# Altium project ACDC.PrjPcb
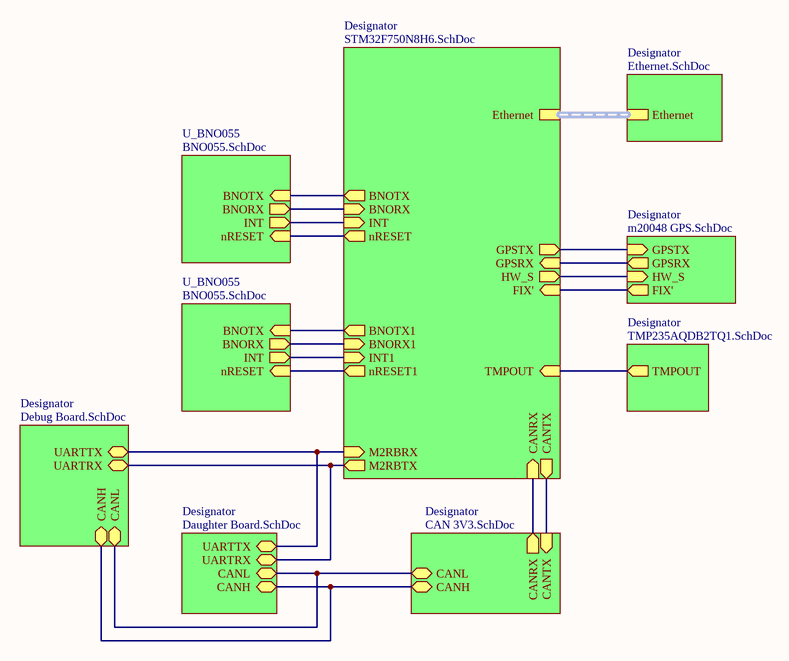
[diagram p0: ACDC.SchDoc]
9 sheets, 151 parts. Net scope: hierarchical (ports join the sheet entries above them; power ports are global).
Board file: ACDC.PcbDoc
Sheets:
  ACDC.SchDoc
    Designator = Daughter Board.SchDoc
    U_BNO055 = BNO055.SchDoc
    Designator = CAN 3V3.SchDoc
    Designator = m20048 GPS.SchDoc
    U_BNO055 = BNO055.SchDoc
    Designator = TMP235AQDB2TQ1.SchDoc
    Designator = STM32F750N8H6.SchDoc
    Designator = Ethernet.SchDoc
    Designator = Debug Board.SchDoc
      Designator = Daughter Board.SchDoc

## Sheet ACDC.SchDoc
size A

### Sub-sheets
Designator = Daughter Board.SchDoc: CANH (bidir), UARTTX (bidir), UARTRX (bidir), CANL (bidir)
Designator = CAN 3V3.SchDoc: CANL (bidir), CANH (bidir), CANRX (out), CANTX (in)
Designator = m20048 GPS.SchDoc: FIX' (out), HW_S (in), GPSRX (out), GPSTX (in)
Designator = TMP235AQDB2TQ1.SchDoc: TMPOUT (out)
Designator = STM32F750N8H6.SchDoc: INT (in), M2RBRX (in), HW_S (out), INT1 (in), nRESET (out), BNORX (in), GPSTX (out), M2RBTX (out), BNOTX (out), CANTX (out), BNORX1 (in), nRESET1 (out), BNOTX1 (out), TMPOUT (in), GPSRX (in), CANRX (in), FIX' (in), Ethernet (harness MII)
Designator = Ethernet.SchDoc: Ethernet (harness MII)
Designator = Debug Board.SchDoc: UARTRX (bidir), CANL (bidir), CANH (bidir), UARTTX (bidir)
U_BNO055 = BNO055.SchDoc: BNORX (out), INT (out), BNOTX (in), nRESET (in)
U_BNO055 = BNO055.SchDoc: BNORX (out), INT (out), BNOTX (in), nRESET (in)

### Nets
BNORX: sheet U_BNO055/BNORX, sheet Designator/BNORX
BNORX1: sheet U_BNO055/BNORX, sheet Designator/BNORX1
BNOTX: sheet U_BNO055/BNOTX, sheet Designator/BNOTX
BNOTX1: sheet U_BNO055/BNOTX, sheet Designator/BNOTX1
CANRX: sheet Designator/CANRX, sheet Designator/CANRX
CANTX: sheet Designator/CANTX, sheet Designator/CANTX
FIX': sheet Designator/FIX', sheet Designator/FIX'
GPSRX: sheet Designator/GPSRX, sheet Designator/GPSRX
GPSTX: sheet Designator/GPSTX, sheet Designator/GPSTX
HW_S: sheet Designator/HW_S, sheet Designator/HW_S
INT: sheet U_BNO055/INT, sheet Designator/INT
INT: sheet U_BNO055/INT, sheet Designator/INT1  [a separate net that carries the same name]
M2RBRX: sheet Designator/UARTTX, sheet Designator/M2RBRX, sheet Designator/UARTTX
M2RBTX: sheet Designator/UARTRX, sheet Designator/M2RBTX, sheet Designator/UARTRX
nRESET: sheet U_BNO055/nRESET, sheet Designator/nRESET
nRESET: sheet U_BNO055/nRESET, sheet Designator/nRESET1  [a separate net that carries the same name]
NetC160_2: sheet Designator/CANH, sheet Designator/CANH, sheet Designator/CANH
NetC162_2: sheet Designator/CANL, sheet Designator/CANL, sheet Designator/CANL
NetC167_1: sheet Designator/TMPOUT, sheet Designator/TMPOUT

## Sheet Daughter Board.SchDoc
size A
Used 2 times, as channels Designator, Designator/Designator. Parts and nets are listed once, with the designators drawn on the sheet.
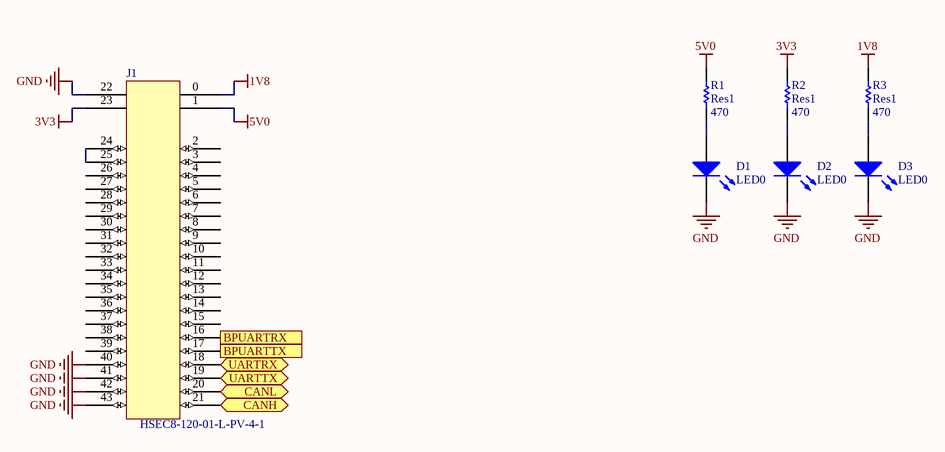
[diagram p1: Daughter Board.SchDoc]

### Parts
D1  LED0  [1608[0603]]
D2  LED0  [1608[0603]]
D3  LED0  [1608[0603]]
J1  HSEC8-120-01-L-PV-4-1  [HSEC8-120-01-L-PV-4-1 Gold Fingers]
R1  Res1  value 470  [1608[0603]]
R2  Res1  value 470  [1608[0603]]
R3  Res1  value 470  [1608[0603]]

### Ports
BPUARTRX (out), BPUARTTX (in), CANH (bidir), CANL (bidir), UARTRX (bidir), UARTTX (bidir)

### Nets
1V8: J1.0 R3.2
3V3: J1.23 R2.2
5V0: J1.1 R1.2
GND: D1.2(K) D2.2(K) D3.2(K) J1.22 J1.40 J1.41 J1.42 J1.43
BPUARTRX: J1.16 ; port BPUARTRX
BPUARTTX: J1.17 ; port BPUARTTX
CANH: J1.21 ; port CANH
CANL: J1.20 ; port CANL
UARTRX: J1.18 ; port UARTRX
UARTTX: J1.19 ; port UARTTX
NetD1_1: D1.1(A) R1.1
NetD2_1: D2.1(A) R2.1
NetD3_1: D3.1(A) R3.1
NetJ1_24: J1.24 J1.25

Not connected (* = marked no-connect by the designer): J1 2(0) 3(0) 4(0) 5(0) 6(0) 7(0) 8(0) 9(0) 10(0) 11(0) 12(0) 13(0) 14(0) 15(0) 26 27 28 29 30 31 32 33 34 35 36 37 38 39

### Channels
Designator: ports BPUARTRX=NetJ1_16 BPUARTTX=NetJ1_17 CANH=NetC160_2 CANL=NetC162_2 UARTRX=M2RBTX UARTTX=M2RBRX
Designator/Designator: designators end in _Designator_Designator; ports BPUARTRX=NetJ1_Designator_Designator_16 BPUARTTX=NetJ1_Designator_Designator_17 CANH=NetJ1_Designator_Designator_21 CANL=NetJ1_Designator_Designator_20 UARTRX=NetJ1_Designator_Designator_18 UARTTX=NetJ1_Designator_Designator_19

### Library data of the parts
R1-R3 = Res1: Resistor; Published: 8-Jun-2000; LatestRevisionDate: 17-Jul-2002; LatestRevisionNote: Re-released for DXP Platform.; PackageReference: AXIAL-0.3; Publisher: Altium Limited; PackageDescription: Axial Device, Thru-Hole; 2 Leads; 0.3 in Pin Spacing
D1-D3 = LED0: Published: 8-Jun-2000; LatestRevisionDate: 08-Jul-2005; LatestRevisionNote: Mech Layer 1 removed.; PackageReference: LED-0; Publisher: Altium Limited; PackageDescription: LED; 2 Leads
J1 = HSEC8-120-01-L-PV-4-1: Supplier 1: Mouser

## Sheet BNO055.SchDoc
size A
Used 2 times, as channels U_BNO055, U_BNO055. Parts and nets are listed once, with the designators drawn on the sheet.
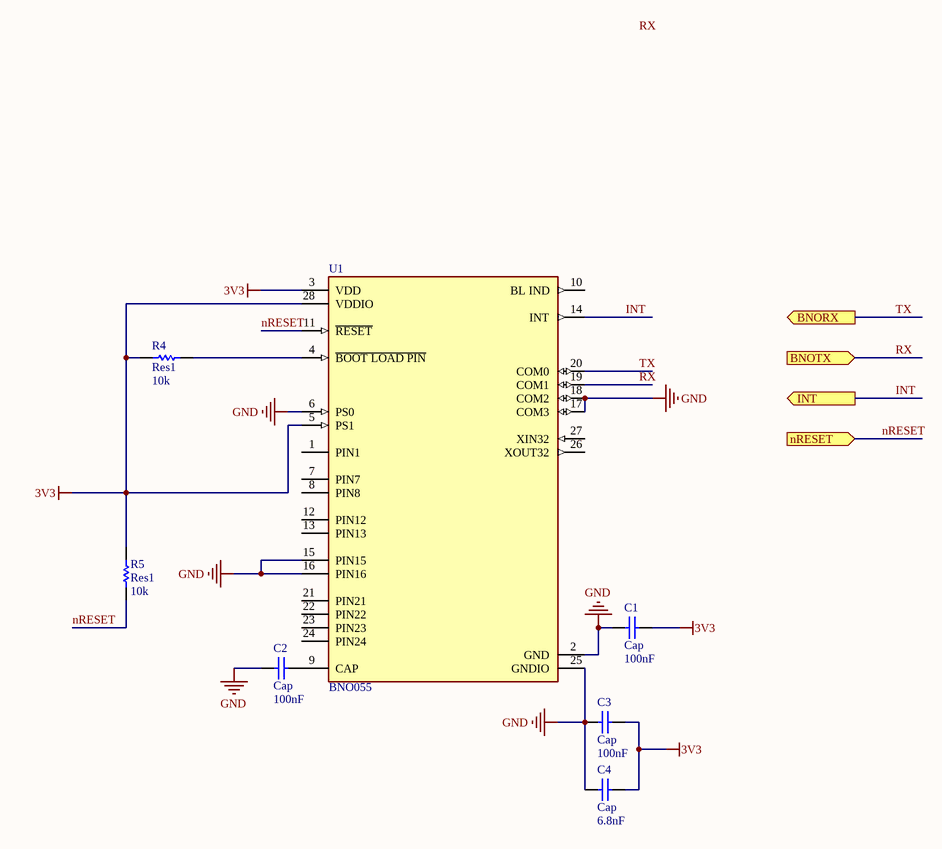
[diagram p2: BNO055.SchDoc]

### Parts
C1  Cap  value 100nF  [0402-A]
C2  Cap  value 100nF  [0402-A]
C3  Cap  value 100nF  [0402-A]
C4  Cap  value 6.8nF  [0402-A]
R4  Res1  value 10k  [0402-A]
R5  Res1  value 10k  [0402-A]
U1  BNO055  [FP-BNO055-MFG]

### Ports
BNORX (out), BNOTX (in), INT (out), nRESET (in)

### Nets
3V3: C1.2 C3.2 C4.2 R4.1 R5.2 U1.3(VDD) U1.5(PS1) U1.28(VDDIO)
GND: C1.1 C2.1 C3.1 C4.1 U1.2(GND) U1.6(PS0) U1.15(PIN15) U1.16(PIN16) U1.17(COM3) U1.18(COM2) U1.25(GNDIO)
INT: U1.14(INT) ; port INT
nRESET: R5.1 U1.11(~{RESET}) ; port nRESET
RX: U1.19(COM1) ; port BNOTX
TX: U1.20(COM0) ; port BNORX
NetC2_2: C2.2 U1.9(CAP)
NetR4_2: R4.2 U1.4(~{BOOT_LOAD_PIN})

Not connected (* = marked no-connect by the designer): U1 1(PIN1) 7(PIN7) 8(PIN8) 10(BL_IND) 12(PIN12) 13(PIN13) 21(PIN21) 22(PIN22) 23(PIN23) 24(PIN24) 26(XOUT32) 27(XIN32)

### Channels
U_BNO055: designators end in _U_BNO0552; ports BNORX=BNORX BNOTX=BNOTX INT=INT nRESET=nRESET
U_BNO055: designators end in _U_BNO0551; ports BNORX=BNORX1 BNOTX=BNOTX1 INT=INT nRESET=nRESET

### Notes on the sheet
- Labels drawn without touching a wire or pin: RX

### Library data of the parts
C1-C4 = Cap: Capacitor; Published: 8-Jun-2000; LatestRevisionDate: 17-Jul-2002; LatestRevisionNote: Re-released for DXP Platform.; PackageReference: RAD-0.3; Publisher: Altium Limited; PackageDescription: Radial Cap, Thru-Hole; 2 Leads; 0.3 in Pin Spacing
R4 R5 = Res1: Resistor; Published: 8-Jun-2000; LatestRevisionDate: 17-Jul-2002; LatestRevisionNote: Re-released for DXP Platform.; PackageReference: AXIAL-0.3; Publisher: Altium Limited; PackageDescription: Axial Device, Thru-Hole; 2 Leads; 0.3 in Pin Spacing
U1 = CMP-191067-000002-1: IMU ACCEL/GYRO/MAG I2C 28LGA; Manufacturer: Bosch Sensortech; Max Supply Voltage: 3.6V; Voltage: 1.7~3.6V; Operating Supply Current: 12.3mA; Gyro Sensitivity: 16LSB/°/s; Sensor Type: Accelerometer,Gyroscope,Magnetometer; Accel Sensitivity: 0.001LSB/g; Min Supply Voltage: 1.7V; Accel Range: 2/4/8/16g; Accel Resolution: 14bits; Sensor Output: I2C,UART; Gyro Range: 125/250/500/1000/2000°/s; Mag Sense Range: 1300-2500uT; Octopart: https://octopart.com/bno055-bosch+sensortec-50309911; Height: 1.18mm; Automotive: No; Mouser Description: BNO055 Series 1.7 to 3.6 V Intelligent 9-Axis Absolute Orientation Sensor-LGA-28; Lead Free: Yes; Temperature Range High: +85°C; Ambient Temperature Range Low: -40°C; Ambient Temperature Range High: +85°C; Device Class L1: Sensors; Device Class L3: Inertial Measurement Units (IMUs); ComponentLink2URL: https://ae-bst.resource.bosch.com/media/_tech/media/datasheets/BST-BNO055-DS000.pdf; Temperature Range Low: -40°C; Manufacturer Part Number: BNO055; Digikey Description: IMU ACCEL/GYRO/MAG I2C 28LGA; Device Class L2: Motion Sensors; RoHS: TRUE; Category: IC; Temperature: -40°C to +85°C; ComponentLink2Description: Datasheet; Package: 0

## Sheet CAN 3V3.SchDoc
size A
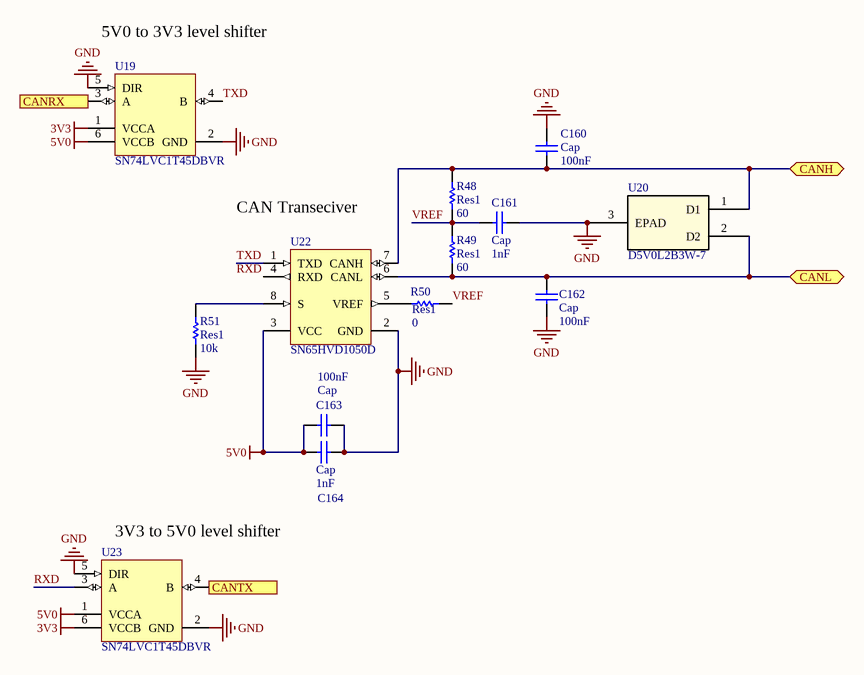
[diagram p3: CAN 3V3.SchDoc]

### Parts
(Parts that share a designator on the sheet are numbered #1, #2 ... from top to bottom, then left to right.)
C160  Cap  value 100nF  [0402-A]
C161  Cap  value 1nF  [0402-A]
C162  Cap  value 100nF  [0402-A]
C163  Cap  value 100nF  [0402-A]
C164  Cap  value 1nF  [0402-A]
R48  Res1  value 60  [0402-A]
R49  Res1  value 60  [0402-A]
R50  Res1  value 0  [0402-A]
R51#1  Res1  value 10k  [0402-A]
U19  SN74LVC1T45DBVR  [DBV0006A_L]
U20  D5V0L2B3W-7  [SOT-323_DIO]
U22  SN65HVD1050D  [D0008A_N]
U23  SN74LVC1T45DBVR  [DBV0006A_L]

### Ports
CANH (bidir), CANL (bidir), CANRX (out), CANTX (in)

### Nets
3V3: U19.1(VCCA) U23.6(VCCB)
5V0: C163.1 C164.2 U19.6(VCCB) U22.3(VCC) U23.1(VCCA)
GND: C160.1 C161.2 C162.1 C163.2 C164.1 R51#1.1 U19.2(GND) U19.5(DIR) U20.3(EPAD) U22.2(GND) U23.2(GND) U23.5(DIR)
CANRX: U19.3(A) ; port CANRX
CANTX: U23.4(B) ; port CANTX
RXD: U23.3(A)
TXD: U19.4(B) U22.1(TXD)
VREF: C161.1 R48.2 R49.2 R50.2
NetC160_2: C160.2 R48.1 U20.1(D1) U22.7(CANH) ; port CANH
NetC162_2: C162.2 R49.1 U20.2(D2) U22.6(CANL) ; port CANL
NetR50_1: R50.1 U22.5(VREF)
NetR51#1_2: R51#1.2 U22.8(S)

Not connected (* = marked no-connect by the designer): U22 4(RXD)

### Notes on the sheet
- (near U19) 5V0 to 3V3 level shifter
- (near U22) CAN Transeciver
- (near U23) 3V3 to 5V0 level shifter
- Labels drawn without touching a wire or pin: RXD

### Library data of the parts
C160-C164 = Cap: Capacitor; Published: 8-Jun-2000; LatestRevisionDate: 17-Jul-2002; LatestRevisionNote: Re-released for DXP Platform.; PackageReference: RAD-0.3; Publisher: Altium Limited; PackageDescription: Radial Cap, Thru-Hole; 2 Leads; 0.3 in Pin Spacing
R48-R50 R51#1 = Res1: Resistor; Published: 8-Jun-2000; LatestRevisionDate: 17-Jul-2002; LatestRevisionNote: Re-released for DXP Platform.; PackageReference: AXIAL-0.3; Publisher: Altium Limited; PackageDescription: Axial Device, Thru-Hole; 2 Leads; 0.3 in Pin Spacing
U19 U23 = CMP-0859-00206-3: Single-Bit Dual-Supply Bus Transceiver with Configurable Voltage Translation and 3-State Outputs, DBV0006A, LARGE T&R; Manufacturer: Texas Instruments; VCC(Max)(V): 5.5; Input Type: CMOS/TTL; Technology Family: LVC; Voltage(Nom)(V): 1.8,2.5,3.3,5; ICC @ Nom Voltage(Max)(mA): 0.004; Bits(#): 1; F @ Nom Voltage(Max)(Mhz): 150; Output Drive (IOL/IOH)(Max)(mA): 32/-32; 3-State Output: Yes; Logic: True; Schmitt Trigger: No; Output Type: CMOS; Rating: Catalog; tpd @ Nom Voltage(Max)(ns): 15.5,8,5.8,4.4; VCC(Min)(V): 1.65; Sub-Family: Dual Supply Translator; Generic Part Number: SN74LVC1T45; PackageReference: DBV0006A; DatasheetVersion: SCES515K; Operating Temperature Range(C): -40 to 85
U20 = D5V0L2B3W-7: No Description Available; Vendor: Diodes Inc; Built_By: EMA_UL_Team; SourceLibrary: DIODESINC_2_2015-08-18; Manufacturer_Part_Number: D5V0L2B3W-7; Copyright: Copyright (C) 2018 Accelerated Designs. All rights reserved; RefDes: RefDes; Type: DEV
U22 = CMP-0315-00048-2: High-Speed EMC Optimized CAN Transceiver, 70 mA, 5 V, -40 to 125 degC, 8-pin SOIC (D), Green (RoHS & no Sb/Br); Manufacturer: Texas Instruments; Bus Fault Voltage(V): -4 to 16; Rating: Catalog; Drivers Per Package: 1; Transient Pulse Protection(V): -200 to 200; ICC(Max)(mA): 70; Supply Voltage(s)(V): 5; PackageVersion: revM, Jun-2011; PartNumber: SN65HVD1050D; PackageReference: D0008A; Code_JEDEC: MS-012AA; Isolated: No; ComponentLink1Description: Datasheet; PackageDescription: 8-Pin Plastic Small Outline Integrated Circuit, 4.9 x 3.9 mm, Pitch 1.27 mm Pitch; Receivers Per Package: 1; Footprint: TJA1050; DatasheetVersion: SLLS632B; SubFamily: CAN; ComponentLink1URL: http://www.ti.com/general/docs/lit/getliterature.tsp?genericPartNumber=SN65HVD1050&fileType=pdf; Eco-Plan: Green (RoHS & no Sb/Br); Mounting Technology: Surface Mount

## Sheet m20048 GPS.SchDoc
size A
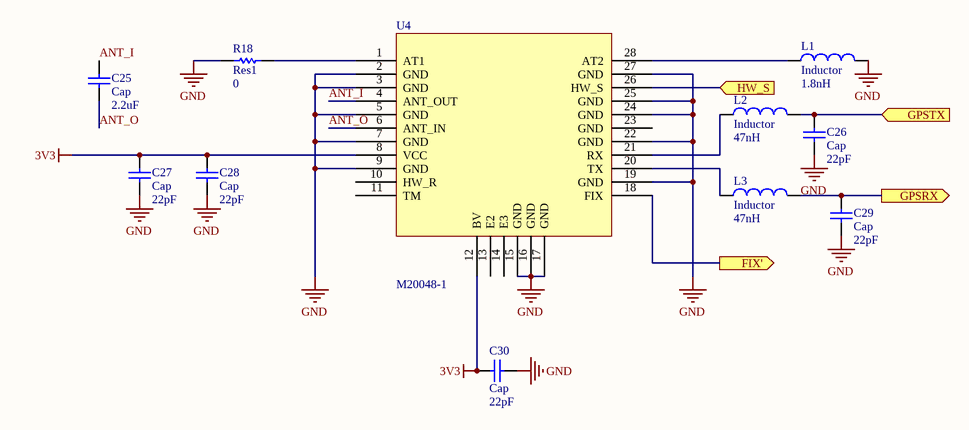
[diagram p4: m20048 GPS.SchDoc]

### Parts
C25  Cap  value 2.2uF  [1608[0603]]
C26  Cap  value 22pF  [0402-A]
C27  Cap  value 22pF  [0402-A]
C28  Cap  value 22pF  [0402-A]
C29  Cap  value 22pF  [0402-A]
C30  Cap  value 22pF  [0402-A]
L1  Inductor  value 1.8nH  [0402-A]
L2  Inductor  value 47nH  [0402-A]
L3  Inductor  value 47nH  [0402-A]
R18  Res1  value 0  [0402-A]
U4  M20048-1  [M20048-1]

### Ports
FIX' (out), GPSRX (out), GPSTX (in), HW_S (in)

### Nets
3V3: C27.2 C28.2 C30.2 U4.8(VCC) U4.12(BV)
GND: C26.1 C27.1 C28.1 C29.1 C30.1 L1.2 R18.1 U4.2(GND) U4.3(GND) U4.5(GND) U4.7(GND) U4.9(GND) U4.15(GND) U4.16(GND) U4.17(GND) U4.19(GND) U4.22(GND) U4.24(GND) U4.25(GND) U4.27(GND)
ANT_I: C25.2 U4.4(ANT_OUT)
ANT_O: C25.1 U4.6(ANT_IN)
FIX': U4.18(FIX) ; port FIX'
GPSRX: C29.2 L3.2 ; port GPSRX
GPSTX: C26.2 L2.2 ; port GPSTX
HW_S: U4.26(HW_S) ; port HW_S
NetL1_1: L1.1 U4.28(AT2)
NetL2_1: L2.1 U4.21(RX)
NetL3_1: L3.1 U4.20(TX)
NetR18_2: R18.2 U4.1(AT1)

Not connected (* = marked no-connect by the designer): U4 10(HW_R) 11(TM) 13(E2) 14(E3) 23(GND)

### Library data of the parts
C25-C30 = Cap: Capacitor; Published: 8-Jun-2000; LatestRevisionDate: 17-Jul-2002; LatestRevisionNote: Re-released for DXP Platform.; PackageReference: RAD-0.3; Publisher: Altium Limited; PackageDescription: Radial Cap, Thru-Hole; 2 Leads; 0.3 in Pin Spacing
L1-L3 = Inductor: Code_IEC: 1005; Published: 8-Jun-2000; LatestRevisionDate: 29-May-2009; LatestRevisionNote: IPC-7351 Footprint Added.; PackageReference: 0402-A; Publisher: Altium Limited; PackageDescription: Chip Inductor; Code_JEITA: 0402
R18 = Res1: Resistor; Published: 8-Jun-2000; LatestRevisionDate: 17-Jul-2002; LatestRevisionNote: Re-released for DXP Platform.; PackageReference: AXIAL-0.3; Publisher: Altium Limited; PackageDescription: Axial Device, Thru-Hole; 2 Leads; 0.3 in Pin Spacing

## Sheet TMP235AQDB2TQ1.SchDoc
size A
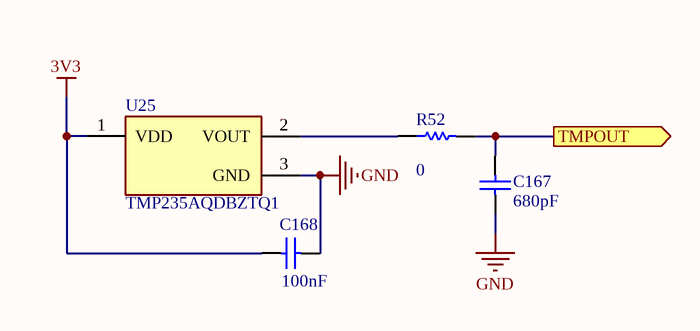
[diagram p5: TMP235AQDB2TQ1.SchDoc]

### Parts
C167  value 680pF  [1608[0603]]  (hidden comment: Cap)
C168  value 100nF  [0402-A]  (hidden comment: Cap)
R52  value 0  [0402-A]  (hidden comment: Res1)
U25  TMP235AQDBZTQ1  [FP-DBZ0003A-MFG]

### Ports
TMPOUT (out)

### Nets
3V3: C168.1 U25.1(VDD)
GND: C167.2 C168.2 U25.3(GND)
NetC167_1: C167.1 R52.2 ; port TMPOUT
NetR52_1: R52.1 U25.2(VOUT)

### Library data of the parts
C167 C168 = Cap: Capacitor; Published: 8-Jun-2000; LatestRevisionDate: 17-Jul-2002; LatestRevisionNote: Re-released for DXP Platform.; PackageReference: RAD-0.3; Publisher: Altium Limited; PackageDescription: Radial Cap, Thru-Hole; 2 Leads; 0.3 in Pin Spacing
R52 = Res1: Resistor; Published: 8-Jun-2000; LatestRevisionDate: 17-Jul-2002; LatestRevisionNote: Re-released for DXP Platform.; PackageReference: AXIAL-0.3; Publisher: Altium Limited; PackageDescription: Axial Device, Thru-Hole; 2 Leads; 0.3 in Pin Spacing
U25 = CMP-04948-000003-1: LOW-POWER HIGH-ACCURACY ANALOG O; Manufacturer: Texas Instruments; Manufacturer Part Number: TMP235A2DBZR; Output Current: 500uA; Operating Supply Current: 9uA; Max Supply Voltage: 5.5V; Max Junction Temp: +150°C; Accuracy: 0.5%; Min Supply Voltage: 2.3V; Standoff Height: 0.01mm; Sensor Output: Analog Voltage; Ambient Temperature Range Low: -40°C; Device Class L2: Temperature and Humidity Sensors; Digikey Description: LOW-POWER HIGH-ACCURACY ANALOG O; Lead Free: Yes; Category: IC; Device Class L3: unset; Temperature Range Low: -40°C; ComponentLink2Description: Datasheet; Package: DBZ0003A; Octopart: https://octopart.com/tmp235a2dbzr-texas+instruments-94966376; Device Class L1: Sensors; Temperature Range High: +150°C; Height: 1.12mm; Temperature: -40°C to +150°C; RoHS: TRUE; Ambient Temperature Range High: +150°C; Automotive: No; ComponentLink2URL: http://www.ti.com/lit/ds/symlink/tmp235.pdf; Mouser Description: ±2°C Analog output temperature sensor, with 10mV /°C gain 3-SOT-23 -40 to 150

## Sheet STM32F750N8H6.SchDoc
size C
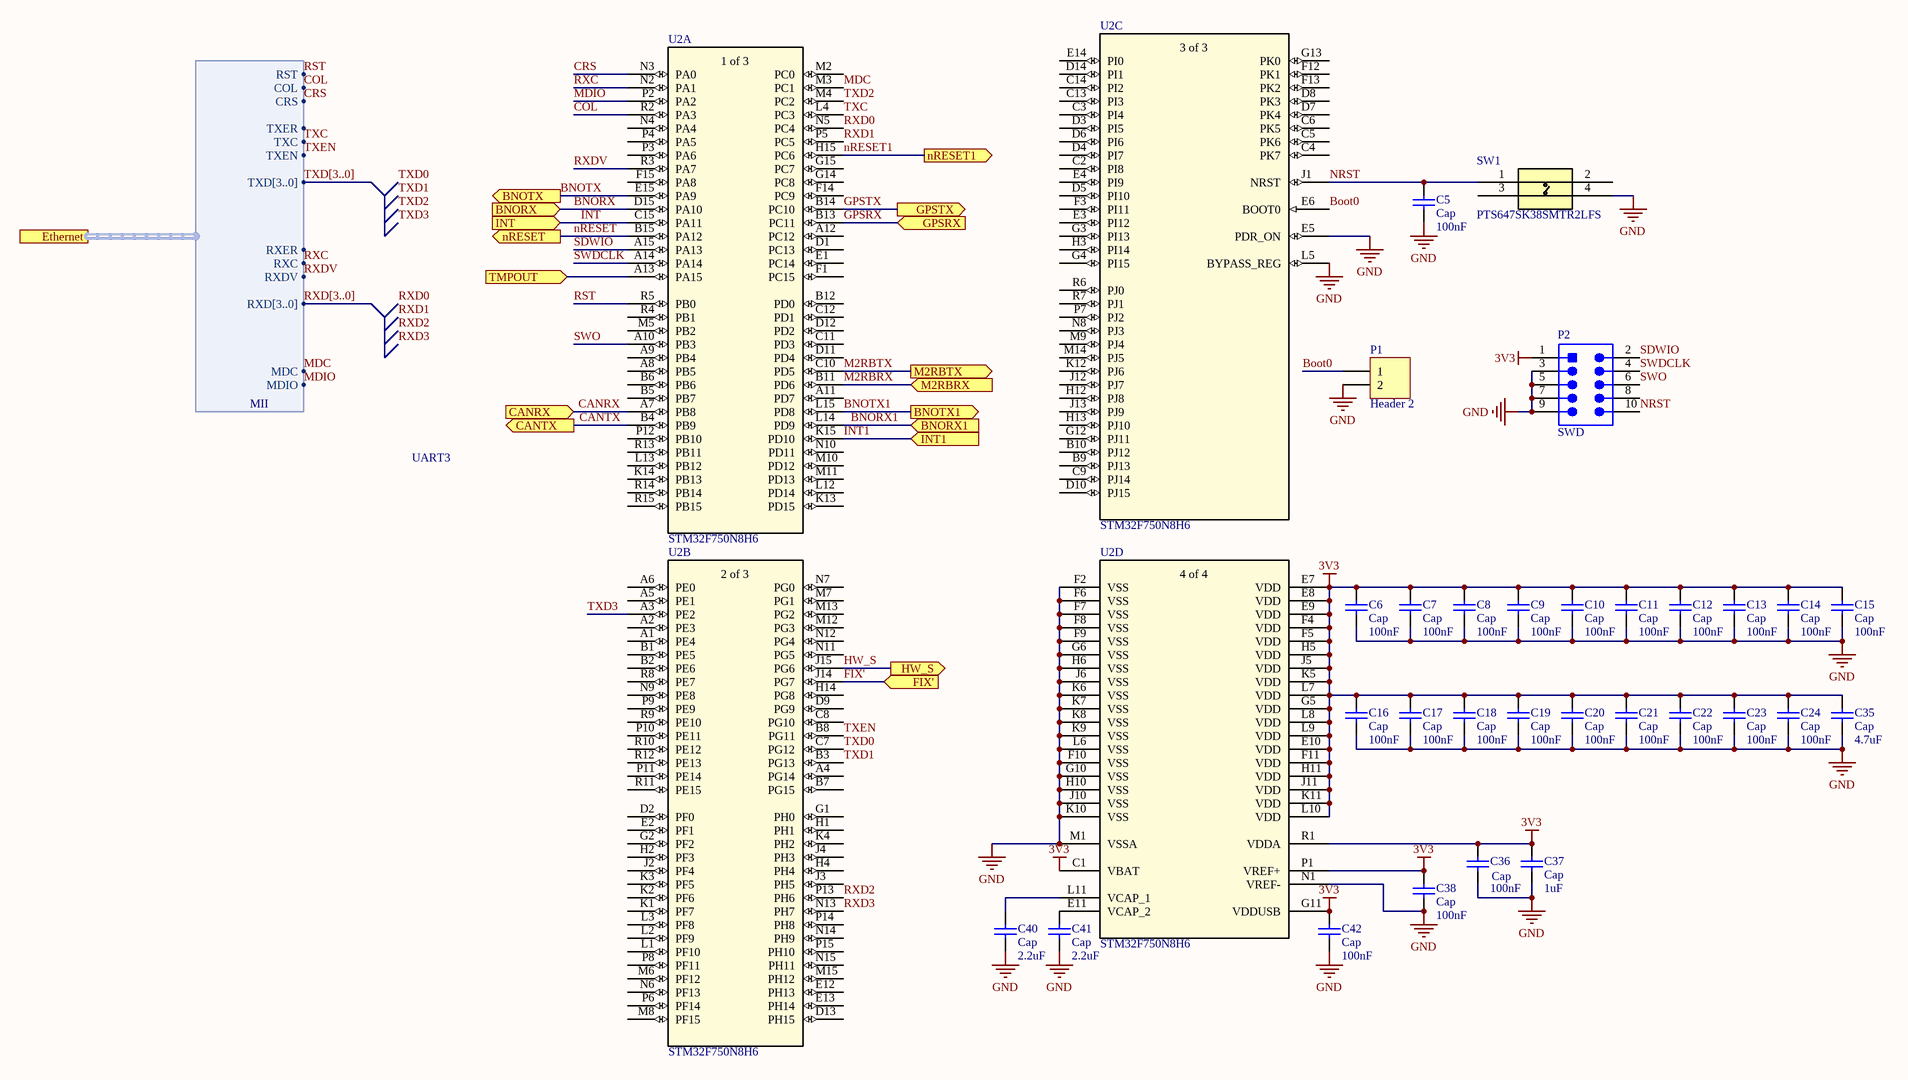
[diagram p6: STM32F750N8H6.SchDoc]

### Parts
(Parts that share a designator on the sheet are numbered #1, #2 ... from top to bottom, then left to right.)
C5  Cap  value 100nF  [1608[0603]]
C6  Cap  value 100nF  [0402-A]
C7  Cap  value 100nF  [0402-A]
C8  Cap  value 100nF  [0402-A]
C9  Cap  value 100nF  [0402-A]
C10  Cap  value 100nF  [0402-A]
C11  Cap  value 100nF  [0402-A]
C12  Cap  value 100nF  [0402-A]
C13  Cap  value 100nF  [0402-A]
C14  Cap  value 100nF  [0402-A]
C15  Cap  value 100nF  [0402-A]
C16  Cap  value 100nF  [0402-A]
C17  Cap  value 100nF  [0402-A]
C18  Cap  value 100nF  [0402-A]
C19  Cap  value 100nF  [0402-A]
C20  Cap  value 100nF  [0402-A]
C21  Cap  value 100nF  [0402-A]
C22  Cap  value 100nF  [0402-A]
C23  Cap  value 100nF  [0402-A]
C24  Cap  value 100nF  [0402-A]
C35  Cap  value 4.7uF  [1608[0603]]
C36  Cap  value 100nF  [0402-A]
C37  Cap  value 1uF  [0402-A]
C38  Cap  value 100nF  [0402-A]
C40  Cap  value 2.2uF  [0402-A]
C41  Cap  value 2.2uF  [0402-A]
C42  Cap  value 100nF  [0402-A]
P1#1  Header 2  [HDR1X2]
P2  SWD  [SMTC-FTSH-105-01-L-DV-K_V]
SW1  PTS647SK38SMTR2LFS  [PTS647SK38SMTR2LFS_CNK]
U2  STM32F750N8H6  [TFBGA216_13X13_STM]  (parts A,B,C,D of 4)

### Ports
BNORX1 (in), BNORX (in), BNOTX1 (out), BNOTX (out), CANRX (in), CANTX (out), Ethernet (harness MII), FIX' (in), GPSRX (in), GPSTX (out), HW_S (out), INT1 (in), INT (in), M2RBRX (in), M2RBTX (out), nRESET1 (out), nRESET (out), TMPOUT (in)

### Harnesses
MII: MDIO, MDC, RXD[3..0], TXD[3..0], RXDV, RXC, RXER, TXEN, TXC, TXER, CRS, COL, RST

### Nets
3V3: C6.2 C7.2 C8.2 C9.2 C10.2 C11.2 C12.2 C13.2 C14.2 C15.2 C16.2 C17.2 C18.2 C19.2 C20.2 C21.2 C22.2 C23.2 C24.2 C35.2 C36.2 C37.2 C38.2 C42.2 P2.1 U2.C1(VBAT) U2.E7(VDD) U2.E8(VDD) U2.E9(VDD) U2.E10(VDD) U2.F4(VDD) U2.F5(VDD) U2.F11(VDD) U2.G5(VDD) U2.G11(VDDUSB) U2.H5(VDD) U2.H11(VDD) U2.J5(VDD) U2.J11(VDD) U2.K5(VDD) U2.K11(VDD) U2.L7(VDD) U2.L8(VDD) U2.L9(VDD) U2.L10(VDD) U2.P1(VREF+) U2.R1(VDDA)
GND: C5.1 C6.1 C7.1 C8.1 C9.1 C10.1 C11.1 C12.1 C13.1 C14.1 C15.1 C16.1 C17.1 C18.1 C19.1 C20.1 C21.1 C22.1 C23.1 C24.1 C35.1 C36.1 C37.1 C38.1 C40.1 C41.1 C42.1 P1#1.2 P2.3 P2.5 P2.7 P2.9 SW1.4 U2.E5(PDR_ON) U2.F2(VSS) U2.F6(VSS) U2.F7(VSS) U2.F8(VSS) U2.F9(VSS) U2.F10(VSS) U2.G6(VSS) U2.G10(VSS) U2.H6(VSS) U2.H10(VSS) U2.J6(VSS) U2.J10(VSS) U2.K6(VSS) U2.K7(VSS) U2.K8(VSS) U2.K9(VSS) U2.K10(VSS) U2.L5(BYPASS_REG) U2.L6(VSS) U2.M1(VSSA) U2.N1(VREF-)
BNORX: U2.D15(PA10) ; port BNORX
BNORX1: U2.L14(PD9) ; port BNORX1
BNOTX: U2.E15(PA9) ; port BNOTX
BNOTX1: U2.L15(PD8) ; port BNOTX1
Boot0: P1#1.1 U2.E6(BOOT0)
CANRX: U2.A7(PB8) ; port CANRX
CANTX: U2.B4(PB9) ; port CANTX
COL: U2.R2(PA3) ; port Ethernet.COL
CRS: U2.N3(PA0) ; port Ethernet.CRS
FIX': U2.J14(PG7) ; port FIX'
GPSRX: U2.B13(PC11) ; port GPSRX
GPSTX: U2.B14(PC10) ; port GPSTX
HW_S: U2.J15(PG6) ; port HW_S
INT: U2.C15(PA11) ; port INT
INT1: U2.K15(PD10) ; port INT1  [project net INT]
M2RBRX: U2.B11(PD6) ; port M2RBRX
M2RBTX: U2.C10(PD5) ; port M2RBTX
MDC: U2.M3(PC1) ; port Ethernet.MDC
MDIO: U2.P2(PA2) ; port Ethernet.MDIO
nRESET: U2.B15(PA12) ; port nRESET
nRESET1: U2.H15(PC6) ; port nRESET1  [project net nRESET]
NRST: C5.2 P2.10 SW1.1 U2.J1(NRST)
RST: U2.R5(PB0) ; port Ethernet.RST
RXC: U2.N2(PA1) ; port Ethernet.RXC
RXD0: U2.N5(PC4)
RXD1: U2.P5(PC5)
RXD2: U2.P13(PH6)
RXD3: U2.N13(PH7)
RXDV: U2.R3(PA7) ; port Ethernet.RXDV
SDWIO: P2.2 U2.A15(PA13)
SWDCLK: P2.4 U2.A14(PA14)
SWO: P2.6 U2.A10(PB3)
TXC: U2.L4(PC3) ; port Ethernet.TXC
TXD0: U2.C7(PG12)
TXD1: U2.B3(PG13)
TXD2: U2.M4(PC2)
TXD3: U2.A3(PE2)
TXEN: U2.B8(PG11) ; port Ethernet.TXEN
NetC40_2: C40.2 U2.L11(VCAP_1)
NetC41_2: C41.2 U2.E11(VCAP_2)
NetC167_1: U2.A13(PA15) ; port TMPOUT

Not connected (* = marked no-connect by the designer): P2 8; SW1 2 3; U2 A1(PE4) A2(PE3) A4(PG14) A5(PE1) A6(PE0) A8(PB5) A9(PB4) A11(PD7) A12(PC12) B1(PE5) B2(PE6) B5(PB7) B6(PB6) B7(PG15) B9(PJ13) B10(PJ12) B12(PD0) C2(PI8) C3(PI4) C4(PK7) C5(PK6) C6(PK5) C8(PG10) C9(PJ14) C11(PD3) C12(PD1) C13(PI3) C14(PI2) D1(PC13) D2(PF0) D3(PI5) D4(PI7) D5(PI10) D6(PI6) D7(PK4) D8(PK3) D9(PG9) D10(PJ15) D11(PD4) D12(PD2) D13(PH15) D14(PI1) E1(PC14) E2(PF1) E3(PI12) E4(PI9) E12(PH13) E13(PH14) E14(PI0) F1(PC15) F3(PI11) F12(PK1) F13(PK2) F14(PC9) F15(PA8) G1(PH0) G2(PF2) G3(PI13) G4(PI15) G12(PJ11) G13(PK0) G14(PC8) G15(PC7) H1(PH1) H2(PF3) H3(PI14) H4(PH4) H12(PJ8) H13(PJ10) H14(PG8) J2(PF4) J3(PH5) J4(PH3) J12(PJ7) J13(PJ9) K1(PF7) K2(PF6) K3(PF5) K4(PH2) K12(PJ6) K13(PD15) K14(PB13) L1(PF10) L2(PF9) L3(PF8) L12(PD14) L13(PB12) M2(PC0) M5(PB2) M6(PF12) M7(PG1) M8(PF15) M9(PJ4) M10(PD12) M11(PD13) M12(PG3) M13(PG2) M14(PJ5) M15(PH12) N4(PA4) N6(PF13) N7(PG0) N8(PJ3) N9(PE8) N10(PD11) N11(PG5) N12(PG4) N14(PH9) N15(PH11) P3(PA6) P4(PA5) P6(PF14) P7(PJ2) P8(PF11) P9(PE9) P10(PE11) P11(PE14) P12(PB10) P14(PH8) P15(PH10) R4(PB1) R6(PJ0) R7(PJ1) R8(PE7) R9(PE10) R10(PE12) R11(PE15) R12(PE13) R13(PB11) R14(PB14) R15(PB15)

### Buses and harness runs
bus RXD[3..0]
bus TXD[3..0]

### Notes on the sheet
- UART3
- Labels drawn without touching a wire or pin: RXD0, RXD1, RXD2, RXD3, TXD0, TXD1, TXD2, TXD3
- (in symbol STM32F750N8H6, part A) 1 of 3
- (in symbol STM32F750N8H6, part B) 2 of 3
- (in symbol STM32F750N8H6, part C) 3 of 3
- (in symbol STM32F750N8H6, part D) 4 of 4

### Library data of the parts
C5-C24 C35-C38 C40-C42 = Cap: Capacitor; Published: 8-Jun-2000; LatestRevisionDate: 17-Jul-2002; LatestRevisionNote: Re-released for DXP Platform.; PackageReference: RAD-0.3; Publisher: Altium Limited; PackageDescription: Radial Cap, Thru-Hole; 2 Leads; 0.3 in Pin Spacing
P1#1 = Header 2: Header, 2-Pin; LatestRevisionDate: 17-Jul-2002; LatestRevisionNote: Re-released for DXP Platform.; Publisher: Altium Limited
P2 = CMP-2000-05353-1: Male Header, Pitch 1.27 mm, 2 x 5 Position, Height 6.25 mm; Manufacturer: Samtec; Pitch: 0.050"(1.27mm); Other Names: Q3937619; Number of Positions: 10; Mating Products: SFMC-105-L2-S-D-TR-ND / -CONN.05"SURFACE10POSSMT / FLE-105-01-G-DV-TR-ND / -CONNSKT1.27MM10POSDUALSMD / FLE-105-01-G-DV-A-P-ND / -CONNSKT1.27MM10POSDUALSMD / FLE-105-01-G-DV-A-ND / -CONNSKT1.27MM10POSDUALSMD / CLP-105-02-G-D-P-TR-ND / -CONNRCPT10POSDUAL.05"SMD / SAM1155-05-ND / -CONNRCPT10POSDUAL.05"SMD / SAM1154-05-ND / -CONNRCPT10POSDUAL.05"SMD / SAM1153-05-ND / -CONNRCPT10POSDUAL.05"SMD / SAM1226-05-ND / -CONNRCPT.05"10POSDUALSMD; Number of Positions Loaded: All; Connector Type: Header,Unshrouded; Product Training Modules: Board-to-BoardConnectors; Datasheet Version: Rev. ET, 10/1995; Number of Rows: 2; Standard Package: 1; Package Description: Male Header, Pitch 1.27 mm, 2 x 5 Position, Height 5.97 mm, Tail Length 4.32 mm; Contact Finish Thickness: 10µin(0.25µm); Series: FTSH; Termination: Solder; Contact Type: MalePin; Color: Black; Package Reference: FTSH-105-01-L-DV-K; Family: RectangularConnectors-Headers,MalePins; Package URL: http://suddendocs.samtec.com/prints/ftsh-1xx-xx-xxx-dv-xxx-footprint.pdf; Packaging: Tube; Mounting Type: SurfaceMount; Category: Connectors,Interconnects; Datasheet URL: http://suddendocs.samtec.com/prints/ftsh-1xx-xx-xxx-dv-xxx-mkt.pdf; Row Spacing: 0.050"(1.27mm); Manufacturer URL: http://www.samtec.com/; Contact Mating Length: 0.120"(3.05mm); Contact Finish: Gold
SW1 = PTS647SK38SMTR2LFS: No Description Available; Vendor: C&K; Built_By: EMA_Cory; SourceLibrary: C&K_2020-05-06; Datasheet: https://www.ckswitches.com/media/2567/pts647.pdf; Manufacturer_Part_Number: PTS647SK38SMTR2LFS; Copyright: Copyright (C) 2018 Accelerated Designs. All rights reserved; RefDes: RefDes; Type: DEV
U2 = STM32F750N8H6: No Description Available; Built_By: EMA_Jessica; Vendor: STMicroelectronics; SourceLibrary: Add_to_database_2020-10-19; Copyright: Copyright (C) 2018 Accelerated Designs. All rights reserved; Manufacturer_Part_Number: STM32F750N8H6; RefDes: RefDes; Type: DEV

## Sheet Ethernet.SchDoc
size E
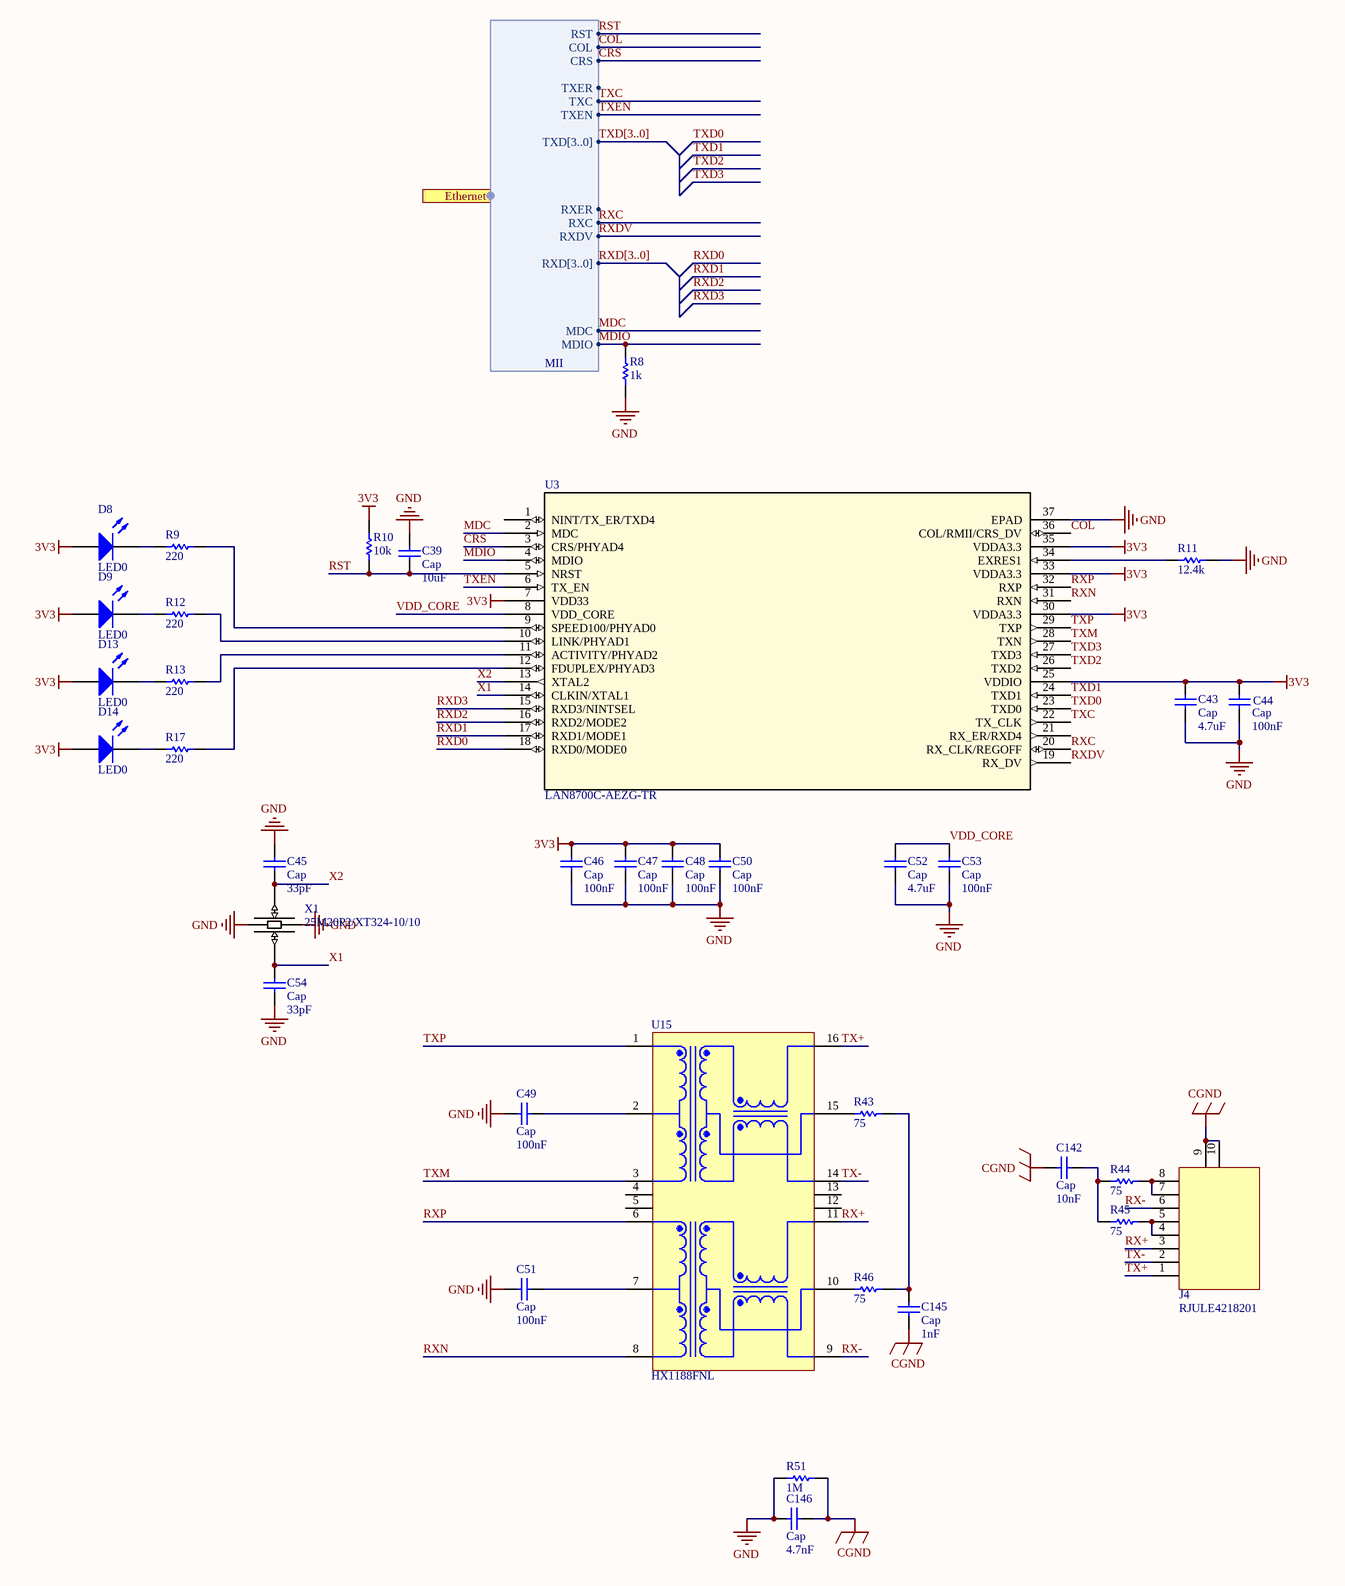
[diagram p7: Ethernet.SchDoc]

### Parts
(Parts that share a designator on the sheet are numbered #1, #2 ... from top to bottom, then left to right.)
C39  Cap  value 10uF  [6-0805_M]
C43  Cap  value 4.7uF  [1608[0603]]
C44  Cap  value 100nF  [0402-A]
C45  Cap  value 33pF  [0402-A]
C46  Cap  value 100nF  [0402-A]
C47  Cap  value 100nF  [0402-A]
C48  Cap  value 100nF  [0402-A]
C49  Cap  value 100nF  [1608[0603]]
C50  Cap  value 100nF  [0402-A]
C51  Cap  value 100nF  [1608[0603]]
C52  Cap  value 4.7uF  [1608[0603]]
C53  Cap  value 100nF  [0402-A]
C54  Cap  value 33pF  [0402-A]
C142  Cap  value 10nF  [0402-A]
C145  Cap  value 1nF  [0402-A]
C146  Cap  value 4.7nF  [C1206]
D8  LED0  [1608[0603]]
D9  LED0  [1608[0603]]
D13  LED0  [1608[0603]]
D14  LED0  [1608[0603]]
J4#1  RJULE4218201  [RJULE4218201]
R8  value 1k  [0402-A]  (hidden comment: Res1)
R9  value 220  [0402-A]  (hidden comment: Res1)
R10  value 10k  [0402-A]  (hidden comment: Res1)
R11  value 12.4k  [0402-A]  (hidden comment: Res1)
R12  value 220  [0402-A]  (hidden comment: Res1)
R13  value 220  [0402-A]  (hidden comment: Res1)
R17  value 220  [0402-A]  (hidden comment: Res1)
R43  value 75  [0402-A]  (hidden comment: Res1)
R44  value 75  [0402-A]  (hidden comment: Res1)
R45  value 75  [0402-A]  (hidden comment: Res1)
R46  value 75  [0402-A]  (hidden comment: Res1)
R51#2  value 1M  [C1206]  (hidden comment: Res1)
U3  LAN8700C-AEZG-TR  [QFN36_6X6MC_MCH]
U15  HX1188FNL  [PULS-HX1188FNL-SMT-16_V]
X1  25M20P2/XT324-10/10  [25M20P2/XT324-10/10]

### Ports
Ethernet (harness MII)

### Harnesses
MII: MDIO, MDC, RXD[3..0], TXD[3..0], RXDV, RXC, RXER, TXEN, TXC, TXER, CRS, COL, RST

### Nets
3V3: C43.1 C44.1 C46.1 C47.1 C48.1 C50.1 D8.1(A) D9.1(A) D13.1(A) D14.1(A) R10.1 U3.7(VDD33) U3.25(VDDIO) U3.30(VDDA3.3) U3.33(VDDA3.3) U3.35(VDDA3.3)
CGND: C142.2 C145.2 C146.2 J4#1.9 J4#1.10 R51#2.1
GND: C39.1 C43.2 C44.2 C45.2 C46.2 C47.2 C48.2 C49.2 C50.2 C51.2 C52.2 C53.2 C54.1 C146.1 R8.2 R11.1 R51#2.2 U3.37(EPAD) X1.2 X1.4
COL: U3.36(COL/RMII/CRS_DV) ; port Ethernet.COL
CRS: U3.3(CRS/PHYAD4) ; port Ethernet.CRS
MDC: U3.2(MDC) ; port Ethernet.MDC
MDIO: R8.1 U3.4(MDIO) ; port Ethernet.MDIO
RST: C39.2 R10.2 U3.5(NRST) ; port Ethernet.RST
RX+: J4#1.3 U15.11(RX+)
RX-: J4#1.6 U15.9(RX-)
RXC: U3.20(RX_CLK/REGOFF) ; port Ethernet.RXC
RXD0: U3.18(RXD0/MODE0)
RXD1: U3.17(RXD1/MODE1)
RXD2: U3.16(RXD2/MODE2)
RXD3: U3.15(RXD3/NINTSEL)
RXDV: U3.19(RX_DV) ; port Ethernet.RXDV
RXN: U3.31(RXN) U15.8(RD-)
RXP: U3.32(RXP) U15.6(RD+)
TX+: J4#1.1 U15.16(TX+)
TX-: J4#1.2 U15.14(TX-)
TXC: U3.22(TX_CLK) ; port Ethernet.TXC
TXD0: U3.23(TXD0)
TXD1: U3.24(TXD1)
TXD2: U3.26(TXD2)
TXD3: U3.27(TXD3)
TXEN: U3.6(TX_EN) ; port Ethernet.TXEN
TXM: U3.28(TXN) U15.3(TD-)
TXP: U3.29(TXP) U15.1(TD+)
VDD_CORE: C52.1 C53.1 U3.8(VDD_CORE)
X1: C54.2 U3.14(CLKIN/XTAL1) X1.1
X2: C45.1 U3.13(XTAL2) X1.3
NetC49_1: C49.1 U15.2(TCT)
NetC51_1: C51.1 U15.7(RCT)
NetC142_1: C142.1 R44.2 R45.2
NetC145_1: C145.1 R43.1 R46.1
NetD8_2: D8.2(K) R9.1
NetD9_2: D9.2(K) R12.1
NetD13_2: D13.2(K) R13.1
NetD14_2: D14.2(K) R17.1
NetJ4#1_4: J4#1.4 J4#1.5 R45.1
NetJ4#1_7: J4#1.7 J4#1.8 R44.1
NetR9_2: R9.2 U3.9(SPEED100/PHYAD0)
NetR11_2: R11.2 U3.34(EXRES1)
NetR12_2: R12.2 U3.10(LINK/PHYAD1)
NetR13_2: R13.2 U3.11(ACTIVITY/PHYAD2)
NetR17_2: R17.2 U3.12(FDUPLEX/PHYAD3)
NetR43_2: R43.2 U15.15(CMT)
NetR46_2: R46.2 U15.10(CMT)

Not connected (* = marked no-connect by the designer): U3 1(NINT/TX_ER/TXD4) 21(RX_ER/RXD4); U15 4(NC) 5(NC) 12(NC) 13(NC)

### Buses and harness runs
bus RXD[3..0]
bus TXD[3..0]

### Library data of the parts
C39 C43-C54 C142 C145 C146 = Cap: Capacitor; Published: 8-Jun-2000; LatestRevisionDate: 17-Jul-2002; LatestRevisionNote: Re-released for DXP Platform.; PackageReference: RAD-0.3; Publisher: Altium Limited; PackageDescription: Radial Cap, Thru-Hole; 2 Leads; 0.3 in Pin Spacing
  C39 C43-C48 C50-C54 C142: Supplier 1: Digi-Key; Supplier Part Number 1: 490-3295-1-ND
R8-R13 R17 R43-R46 R51#2 = Res1: Resistor; Published: 8-Jun-2000; LatestRevisionDate: 17-Jul-2002; LatestRevisionNote: Re-released for DXP Platform.; PackageReference: AXIAL-0.3; Publisher: Altium Limited; PackageDescription: Axial Device, Thru-Hole; 2 Leads; 0.3 in Pin Spacing
U3 = LAN8700C-AEZG-TR: No Description Available; Mfr_Name: Microchip; Copyright: Copyright (C) 2021 Ultra Librarian. All rights reserved.; Manufacturer_Part_Number: LAN8700C-AEZG-TR; Digi-Key_Part_Number_1: LAN8700C-AEZG-CT-ND; Digi-Key_Part_Number_2: LAN8700C-AEZG-DKR-ND; Digi-Key_Part_Number_3: LAN8700C-AEZG-TR-ND; RefDes: RefDes; Type: DEV
U15 = CMP-2000-06431-1: Telecom Transformer 1:1/1:1, -40 to 85 degC, 16-Pin SMT, RoHS, Tube; Manufacturer: Pulse Electronics; Turns Ratio - Primary: Secondary:1:1Transmitter,1:1Receiver; Online Catalog: HX1188; Other Names: 553-2200; Other Related Documents: PackagesFNLvs.NL; Transformer Type: IsolationandDataInterface(Encapsulated); Datasheet Version: Rev. B, 05/2014; Family: PulseTransformers; PartNumber: HX1188FNL; Manufacturer URL: http://www.pulseelectronics.com/; Package Description: 16-Pin Surface Mount Device, Body 12.7 x 9.09 mm, Pitch 1.27 mm; Mounting Type: SurfaceMount; Package Reference: SMT; Mounting Technology: SurfaceMount; Datasheet URL: http://productfinder.pulseeng.com/products/datasheets/HX1188FNL.pdf;jsessionid=D0CB5525A348FF42F5E5BE320CB10324; Height - Seated (Max): 5.99mm; Category: Transformers; Standard Package: 40; Size / Dimension: 12.70mmLx9.00mmW
D8 D9 D13 D14 = LED0: Published: 8-Jun-2000; LatestRevisionDate: 08-Jul-2005; LatestRevisionNote: Mech Layer 1 removed.; PackageReference: LED-0; Publisher: Altium Limited; PackageDescription: LED; 2 Leads

## Sheet Debug Board.SchDoc
size A
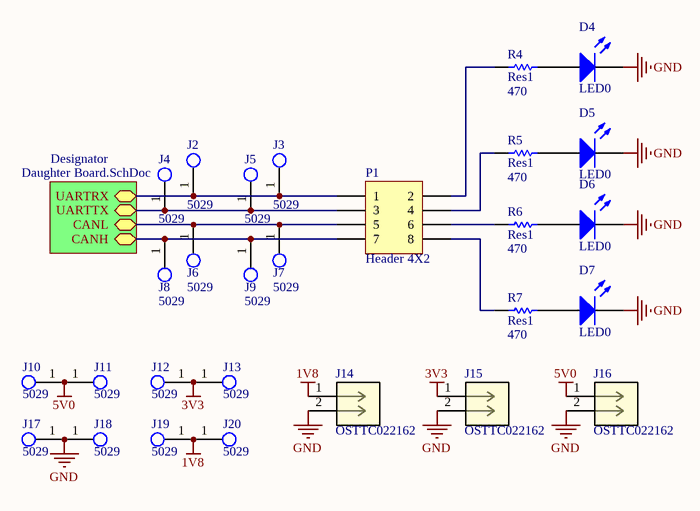
[diagram p8: Debug Board.SchDoc]

### Parts
(Parts that share a designator on the sheet are numbered #1, #2 ... from top to bottom, then left to right.)
D4  LED0  [1608[0603]]
D5  LED0  [1608[0603]]
D6  LED0  [1608[0603]]
D7  LED0  [1608[0603]]
J2  5029  [5029]
J3  5029  [Exposed Pad]
J4#2  5029  [5029]
J5  5029  [Exposed Pad]
J6  5029  [5029]
J7  5029  [Exposed Pad]
J8  5029  [5029]
J9  5029  [Exposed Pad]
J10  5029  [Exposed Pad]
J11  5029  [5029]
J12  5029  [Exposed Pad]
J13  5029  [5029]
J14  OSTTC022162  [CONN_OSTTC022162_OST]
J15  OSTTC022162  [CONN_OSTTC022162_OST]
J16  OSTTC022162  [CONN_OSTTC022162_OST]
J17  5029  [Exposed Pad]
J18  5029  [5029]
J19  5029  [Exposed Pad]
J20  5029  [5029]
P1#2  Header 4X2  [HDR2X4]
R4  Res1  value 470  [1608[0603]]
R5  Res1  value 470  [1608[0603]]
R6  Res1  value 470  [1608[0603]]
R7  Res1  value 470  [1608[0603]]

### Sub-sheets
Designator = Daughter Board.SchDoc: CANH (bidir), CANL (bidir), UARTTX (bidir), UARTRX (bidir)

### Nets
1V8: J14.1 J19.1 J20.1
3V3: J12.1 J13.1 J15.1
5V0: J10.1 J11.1 J16.1
GND: D4.2(K) D5.2(K) D6.2(K) D7.2(K) J14.2 J15.2 J16.2 J17.1 J18.1
NetD4_1: D4.1(A) R4.1
NetD5_1: D5.1(A) R5.1
NetD6_1: D6.1(A) R6.1
NetD7_1: D7.1(A) R7.1
NetJ1_Designator_Designator_18: J2.1 J3.1 P1#2.1 ; sheet Designator/UARTRX
NetJ1_Designator_Designator_19: J4#2.1 J5.1 P1#2.3 ; sheet Designator/UARTTX
NetJ1_Designator_Designator_20: J6.1 J7.1 P1#2.5 ; sheet Designator/CANL
NetJ1_Designator_Designator_21: J8.1 J9.1 P1#2.7 ; sheet Designator/CANH
NetP1#2_2: P1#2.2 R4.2
NetP1#2_4: P1#2.4 R5.2
NetP1#2_6: P1#2.6 R6.2
NetP1#2_8: P1#2.8 R7.2

### Library data of the parts
J14-J16 = OSTTC022162: No Description Available; Vendor: On Shore Technology Inc; Built_By: EMA_Cory; SourceLibrary: On_Shore_Technology_2019-12-02; Manufacturer_Part_Number: OSTTC022162; Copyright: Copyright (C) 2018 Accelerated Designs. All rights reserved; RefDes: RefDes; Type: DEV
P1#2 = Header 4X2: Header, 4-Pin, Dual row; LatestRevisionDate: 17-Jul-2002; LatestRevisionNote: Re-released for DXP Platform.; Publisher: Altium Limited
R4-R7 = Res1: Resistor; Published: 8-Jun-2000; LatestRevisionDate: 17-Jul-2002; LatestRevisionNote: Re-released for DXP Platform.; PackageReference: AXIAL-0.3; Publisher: Altium Limited; PackageDescription: Axial Device, Thru-Hole; 2 Leads; 0.3 in Pin Spacing
D4-D7 = LED0: Published: 8-Jun-2000; LatestRevisionDate: 08-Jul-2005; LatestRevisionNote: Mech Layer 1 removed.; PackageReference: LED-0; Publisher: Altium Limited; PackageDescription: LED; 2 Leads

## Nets that join several sheets
1V8: Designator (J1.0 R3.2), Debug Board (J14.1 J19.1 J20.1), Designator/Designator (J1_Designator_Designator.0 R3_Designator_Designator.2)
3V3: Designator (J1.23 R2.2), U_BNO055 (8 pins), CAN 3V3 (U19.1 U23.6), m20048 GPS (5 pins), U_BNO055 (8 pins), TMP235AQDB2TQ1 (C168.1 U25.1), STM32F750N8H6 (47 pins), Ethernet (16 pins), Debug Board (J12.1 J13.1 J15.1), Designator/Designator (J1_Designator_Designator.23 R2_Designator_Designator.2)
5V0: Designator (J1.1 R1.2), CAN 3V3 (5 pins), Debug Board (J10.1 J11.1 J16.1), Designator/Designator (J1_Designator_Designator.1 R1_Designator_Designator.2)
GND: Designator (8 pins), U_BNO055 (11 pins), CAN 3V3 (12 pins), m20048 GPS (20 pins), U_BNO055 (11 pins), TMP235AQDB2TQ1 (C167.2 C168.2 U25.3), STM32F750N8H6 (55 pins), Ethernet (20 pins), Debug Board (9 pins), Designator/Designator (8 pins)
BNORX: U_BNO055 (U1_U_BNO0552.20), STM32F750N8H6 (U2.D15)
BNORX1: U_BNO055 (U1_U_BNO0551.20), STM32F750N8H6 (U2.L14)
BNOTX: U_BNO055 (U1_U_BNO0552.19), STM32F750N8H6 (U2.E15)
BNOTX1: U_BNO055 (U1_U_BNO0551.19), STM32F750N8H6 (U2.L15)
CANRX: CAN 3V3 (U19.3), STM32F750N8H6 (U2.A7)
CANTX: CAN 3V3 (U23.4), STM32F750N8H6 (U2.B4)
COL: STM32F750N8H6 (U2.R2), Ethernet (U3.36)
CRS: STM32F750N8H6 (U2.N3), Ethernet (U3.3)
FIX': m20048 GPS (U4.18), STM32F750N8H6 (U2.J14)
GPSRX: m20048 GPS (C29.2 L3.2), STM32F750N8H6 (U2.B13)
GPSTX: m20048 GPS (C26.2 L2.2), STM32F750N8H6 (U2.B14)
HW_S: m20048 GPS (U4.26), STM32F750N8H6 (U2.J15)
INT: U_BNO055 (U1_U_BNO0552.14), STM32F750N8H6 (U2.C15)
INT: U_BNO055 (U1_U_BNO0551.14), STM32F750N8H6 (U2.K15)
M2RBRX: Designator (J1.19), STM32F750N8H6 (U2.B11)
M2RBTX: Designator (J1.18), STM32F750N8H6 (U2.C10)
MDC: STM32F750N8H6 (U2.M3), Ethernet (U3.2)
MDIO: STM32F750N8H6 (U2.P2), Ethernet (R8.1 U3.4)
NetC160_2: Designator (J1.21), CAN 3V3 (C160.2 R48.1 U20.1 U22.7)
NetC162_2: Designator (J1.20), CAN 3V3 (C162.2 R49.1 U20.2 U22.6)
NetC167_1: TMP235AQDB2TQ1 (C167.1 R52.2), STM32F750N8H6 (U2.A13)
NetJ1_Designator_Designator_18: Debug Board (J2.1 J3.1 P1#2.1), Designator/Designator (J1_Designator_Designator.18)
NetJ1_Designator_Designator_19: Debug Board (J4#2.1 J5.1 P1#2.3), Designator/Designator (J1_Designator_Designator.19)
NetJ1_Designator_Designator_20: Debug Board (J6.1 J7.1 P1#2.5), Designator/Designator (J1_Designator_Designator.20)
NetJ1_Designator_Designator_21: Debug Board (J8.1 J9.1 P1#2.7), Designator/Designator (J1_Designator_Designator.21)
nRESET: U_BNO055 (R5_U_BNO0552.1 U1_U_BNO0552.11), STM32F750N8H6 (U2.B15)
nRESET: U_BNO055 (R5_U_BNO0551.1 U1_U_BNO0551.11), STM32F750N8H6 (U2.H15)
RST: STM32F750N8H6 (U2.R5), Ethernet (C39.2 R10.2 U3.5)
RXC: STM32F750N8H6 (U2.N2), Ethernet (U3.20)
RXD0: STM32F750N8H6 (U2.N5), Ethernet (U3.18)
RXD1: STM32F750N8H6 (U2.P5), Ethernet (U3.17)
RXD2: STM32F750N8H6 (U2.P13), Ethernet (U3.16)
RXD3: STM32F750N8H6 (U2.N13), Ethernet (U3.15)
RXDV: STM32F750N8H6 (U2.R3), Ethernet (U3.19)
TXC: STM32F750N8H6 (U2.L4), Ethernet (U3.22)
TXD0: STM32F750N8H6 (U2.C7), Ethernet (U3.23)
TXD1: STM32F750N8H6 (U2.B3), Ethernet (U3.24)
TXD2: STM32F750N8H6 (U2.M4), Ethernet (U3.26)
TXD3: STM32F750N8H6 (U2.A3), Ethernet (U3.27)
TXEN: STM32F750N8H6 (U2.B8), Ethernet (U3.6)